# Altium schematic sheet low_voltage_rails.SchDoc: Fault-Tolerant Quadcopter
size A; DrawnBy: Vaughn Kottler; Engineer: Vaughn Kottler; Revision: A
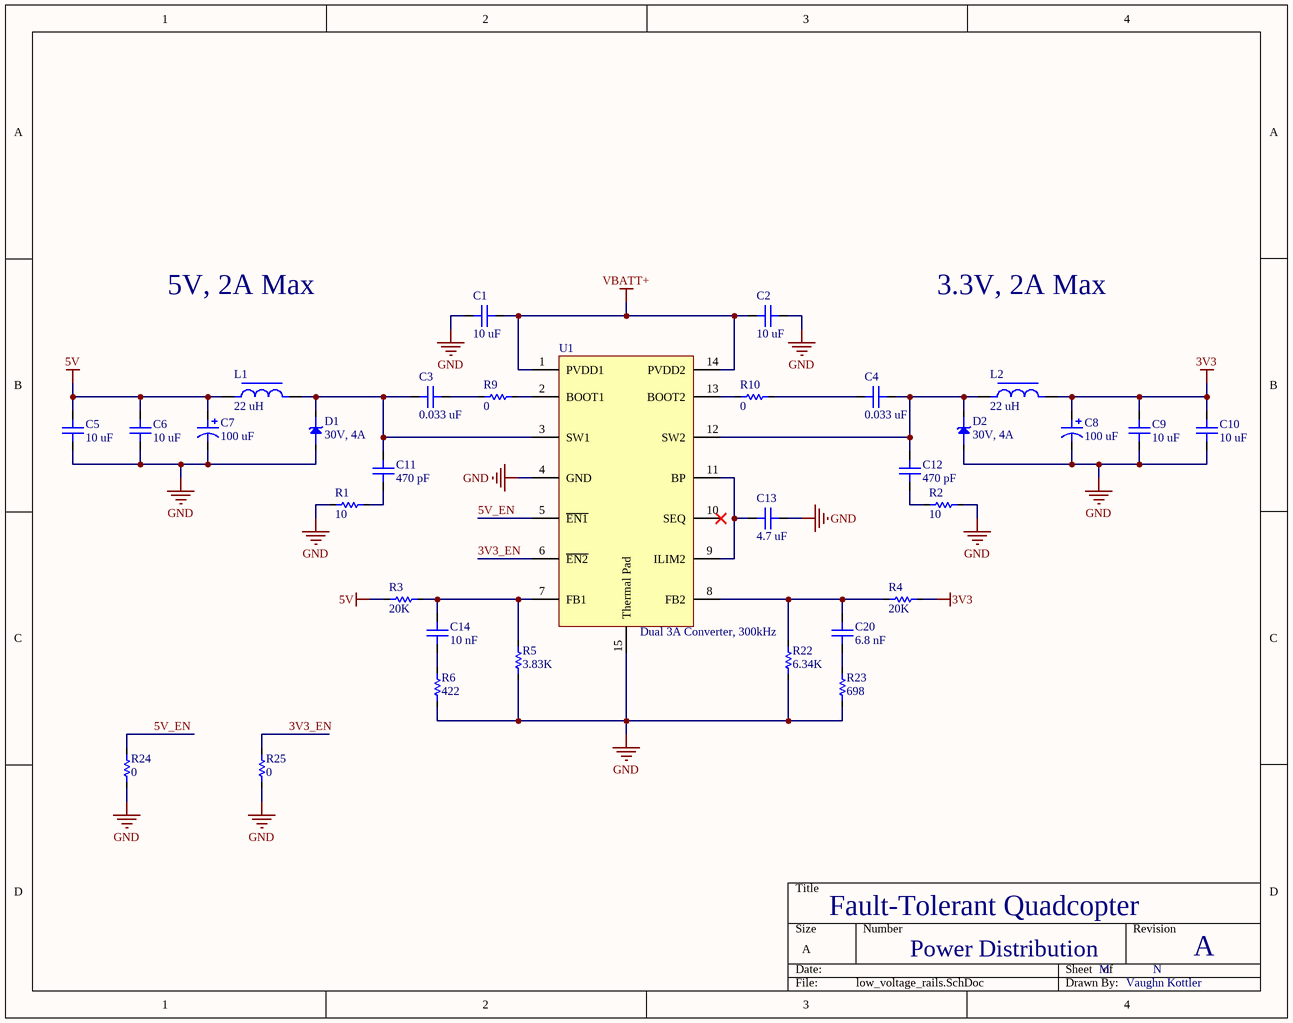
[diagram p0: low_voltage_rails.SchDoc]

## Parts
C1  10 uF  [CAP-CER-1206]
C2  10 uF  [CAP-CER-1206]
C3  0.033 uF  [CAP-CER-0603]
C4  0.033 uF  [CAP-CER-0603]
C5  10 uF  [CAP-CER-0805-TALL]
C6  10 uF  [CAP-CER-0805-TALL]
C7  100 uF  [CAP-CAN-8.3x8.3]
C8  100 uF  [CAP-CAN-8.3x8.3]
C9  10 uF  [CAP-CER-0805-TALL]
C10  10 uF  [CAP-CER-0805-TALL]
C11  470 pF  [CAP-CER-0603]
C12  470 pF  [CAP-CER-0603]
C13  4.7 uF  [CAP-CER-0805-TALL]
C14  10 nF  [CAP-CER-0603]
C20  6.8 nF  [CAP-CER-0603]
D1  30V, 4A  [DO-214AB-SMC]
D2  30V, 4A  [DO-214AB-SMC]
L1  22 uH  [IND-12mm]
L2  22 uH  [IND-12mm]
R1  10  [RES-0603]
R2  10  [RES-0603]
R3  20K  [RES-0603]
R4  20K  [RES-0603]
R5  3.83K  [RES-0603]
R6  422  [RES-0603]
R9  0  [RES-0603]
R10  0  [RES-0603]
R22  6.34K  [RES-0603]
R23  698  [RES-0603]
R24  0  [RES-0805]
R25  0  [RES-0805]
U1  Dual 3A Converter, 300kHz  [14-HTSSOP]

## Nets
3V3: C8.1 C9.2 C10.2 L2.2 R4.2
5V: C5.2 C6.2 C7.1 L1.1 R3.1
GND: C1.1 C2.2 C5.1 C6.1 C7.2 C8.2 C9.1 C10.1 C13.1 D1.1(CT) D2.1(CT) R1.2 R2.1 R5.1 R6.1 R22.1 R23.1 R24.1 R25.1 U1.4(GND) U1.15(Thermal_Pad)
VBATT+: C1.2 C2.1 U1.1(PVDD1) U1.14(PVDD2)
3V3_EN: R25.2 U1.6(~{EN2})
5V_EN: R24.2 U1.5(~{EN1})
NetC3_1: C3.1 C11.2 D1.2(AN) L1.2 U1.3(SW1)
NetC3_2: C3.2 R9.1
NetC4_1: C4.1 R10.2
NetC4_2: C4.2 C12.2 D2.2(AN) L2.1 U1.12(SW2)
NetC11_1: C11.1 R1.1
NetC12_1: C12.1 R2.2
NetC13_2: C13.2 U1.9(ILIM2) U1.11(BP)
NetC14_1: C14.1 R6.2
NetC14_2: C14.2 R3.2 R5.2 U1.7(FB1)
NetC20_1: C20.1 R23.2
NetC20_2: C20.2 R4.1 R22.2 U1.8(FB2)
NetR9_2: R9.2 U1.2(BOOT1)
NetR10_1: R10.1 U1.13(BOOT2)

Not connected (* = marked no-connect by the designer): U1 10(SEQ)*

## Notes on the sheet
- 5V, 2A Max
- 3.3V, 2A Max
- Power Distribution
- M
- N

## Library data of the parts
C1 C2 = CAP-CER-10uF-25V-1206: ±20%, 1206; ComponentLink1Description: Datasheet; ComponentLink1URL: https://search.murata.co.jp/Ceramy/image/img/A01X/G101/ENG/GRM21BR61E106KA73-01.pdf; Supplier 1: Digi-Key; Supplier Part Number 1: 445-14678-6-ND
C3 C4 = CAP-CER-0.033uF-25V: 10%, 0603; Supplier 1: Digi-Key; Supplier Part Number 1: 1276-6675-6-ND
C5 C6 C9 C10 = CAP-CER-10uF-25V: ±10%, 0805; Supplier 1: Digi-Key; ComponentLink1Description: Datasheet; ComponentLink1URL: https://search.murata.co.jp/Ceramy/image/img/A01X/G101/ENG/GRM21BR61E106KA73-01.pdf; Supplier Part Number 1: 490-5523-6-ND
C7 C8 = CAP-CAN-100uF-10V: ±20%, 8.3mm x 8.3mm; Supplier 1: Digi-Key; Supplier Part Number 1: PCE3989DKR-ND
C11 C12 = CAP-CER-470pF-50V: 20%, 0603; Supplier 1: Digi-Key; Supplier Part Number 1: 311-3377-6-ND
C13 = CAP-CER-4.7uF-10V: ±10%, 0805; ComponentLink1Description: Capacitor Book (Amazon); ComponentLink1URL: https://www.amazon.com/gp/product/B0728HBDRW/
C14 = CAP-CER-10nF-25V: ±20%, 0603; Supplier 1: Digi-Key; Supplier Part Number 1: 399-8989-6-ND
C20 = CAP-CER-6.8nF-25V: ±10%, 0603; Supplier 1: Digi-Key; Supplier Part Number 1: 732-7982-6-ND
D1 D2 = DIO-500mV-30V-4A: Schottky, SMC (DO-214AB); ComponentLink1Description: Resistor Book (Amazon); ComponentLink1URL: https://www.amazon.com/gp/product/B071J21FYF/; Supplier 1: Digi-Key; Supplier Part Number 1: MBRS330T3GOSDKR-ND
L1 L2 = IND-22uH-38m-5.2A: ±20%, 8 MHz res; Supplier 1: Digi-Key; Supplier Part Number 1: SRR1210-220MDKR-ND; ComponentLink1Description: Datasheet; ComponentLink1URL: https://www.bourns.com/docs/Product-Datasheets/SRR1210.pdf
R1 R2 = RES-10-1/4W: 5%, 0603; Supplier 1: Digi-Key; Supplier Part Number 1: RHM10DDKR-ND
R3 R4 = RES-20K-1/10W: 1%, 0603; Supplier 1: Digi-Key; Supplier Part Number 1: P20.0KHDKR-ND
R5 = RES-3.83K-1/10W: 1%, 0603; Supplier 1: Digi-Key; Supplier Part Number 1: P3.83KHDKR-ND
R6 = RES-422-1/10W: 1%, 0603; Supplier 1: Digi-Key; Supplier Part Number 1: 311-422HRCT-ND
R9 R10 = RES-0-1/10W: 0603; Supplier 1: Digi-Key; Supplier Part Number 1: P0.0GDKR-ND
R22 = RES-6.34K-1/10W: 1%, 0603; Supplier 1: Digi-Key; Supplier Part Number 1: 311-6.34KHRDKR-ND
R23 = RES-698-1/10W: 1%, 0603; Supplier 1: Digi-Key; Supplier Part Number 1: RMCF0603FT698RDKR-ND
R24 R25 = RES-0-1/8W: 0805; ComponentLink1Description: Resistor Book (Amazon); ComponentLink1URL: https://www.amazon.com/gp/product/B071J21FYF/
U1 = TPS54383: Dual 3A Non-Synchronous Converters with Integrated High-Side MOSFET; ComponentLink1Description: Datasheet; ComponentLink1URL: http://www.ti.com/lit/ds/symlink/tps54386.pdf; Supplier 1: Digi-Key; Supplier Part Number 1: 296-23087-6-ND